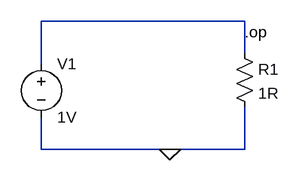
[diagram p0: schematic VSource_R.asc]
VSource_R.asc, the LTspice schematic file:
Version 4
SHEET 1 880 680
WIRE 336 208 32 208
WIRE 336 256 336 208
WIRE 32 272 32 208
WIRE 32 400 32 352
WIRE 224 400 32 400
WIRE 336 400 336 336
WIRE 336 400 224 400
FLAG 224 400 0
SYMBOL voltage 32 256 R0
SYMATTR InstName V1
SYMATTR Value 1V
SYMBOL res 320 240 R0
SYMATTR InstName R1
SYMATTR Value 1R
TEXT 336 224 Left 2 !.op

The netlist it stands for:
* VSource_R.asc
V1 N001 0 1V
R1 N001 0 1R
.op
.backanno
.end